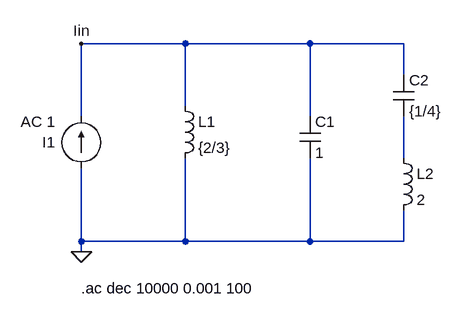
[diagram p0: schematic punto1b.asc]
punto1b.asc, the LTspice schematic file:
Version 4
SHEET 1 1000 760
WIRE 176 -16 16 -16
WIRE 368 -16 176 -16
WIRE 512 -16 368 -16
WIRE 512 32 512 -16
WIRE 176 80 176 -16
WIRE 16 96 16 -16
WIRE 368 96 368 -16
WIRE 512 160 512 96
WIRE 16 288 16 176
WIRE 176 288 176 160
WIRE 176 288 16 288
WIRE 368 288 368 160
WIRE 368 288 176 288
WIRE 512 288 512 240
WIRE 512 288 368 288
WIRE 16 304 16 288
FLAG 16 304 0
FLAG 16 -16 Iin
SYMBOL current 16 176 R180
WINDOW 0 40 40 Left 2
WINDOW 3 40 72 Left 2
SYMATTR InstName I1
SYMATTR Value AC 1
SYMBOL ind 160 64 R0
SYMATTR InstName L1
SYMATTR Value {2/3}
SYMATTR SpiceLine Rser=0 Rpar=1e30
SYMBOL ind 496 144 R0
SYMATTR InstName L2
SYMATTR Value 2
SYMATTR SpiceLine Rser=0 Rpar=1e30
SYMBOL cap 352 96 R0
SYMATTR InstName C1
SYMATTR Value 1
SYMBOL cap 496 32 R0
SYMATTR InstName C2
SYMATTR Value {1/4}
TEXT 16 360 Left 2 !.ac dec 10000 0.001 100

The netlist it stands for:
* punto1b.asc
I1 0 Iin AC 1
L1 Iin 0 {2/3} Rser=0 Rpar=1e30
L2 N001 0 2 Rser=0 Rpar=1e30
C1 Iin 0 1
C2 Iin N001 {1/4}
.ac dec 10000 0.001 100
.backanno
.end